# Altium project OpenAXES.PrjPCB
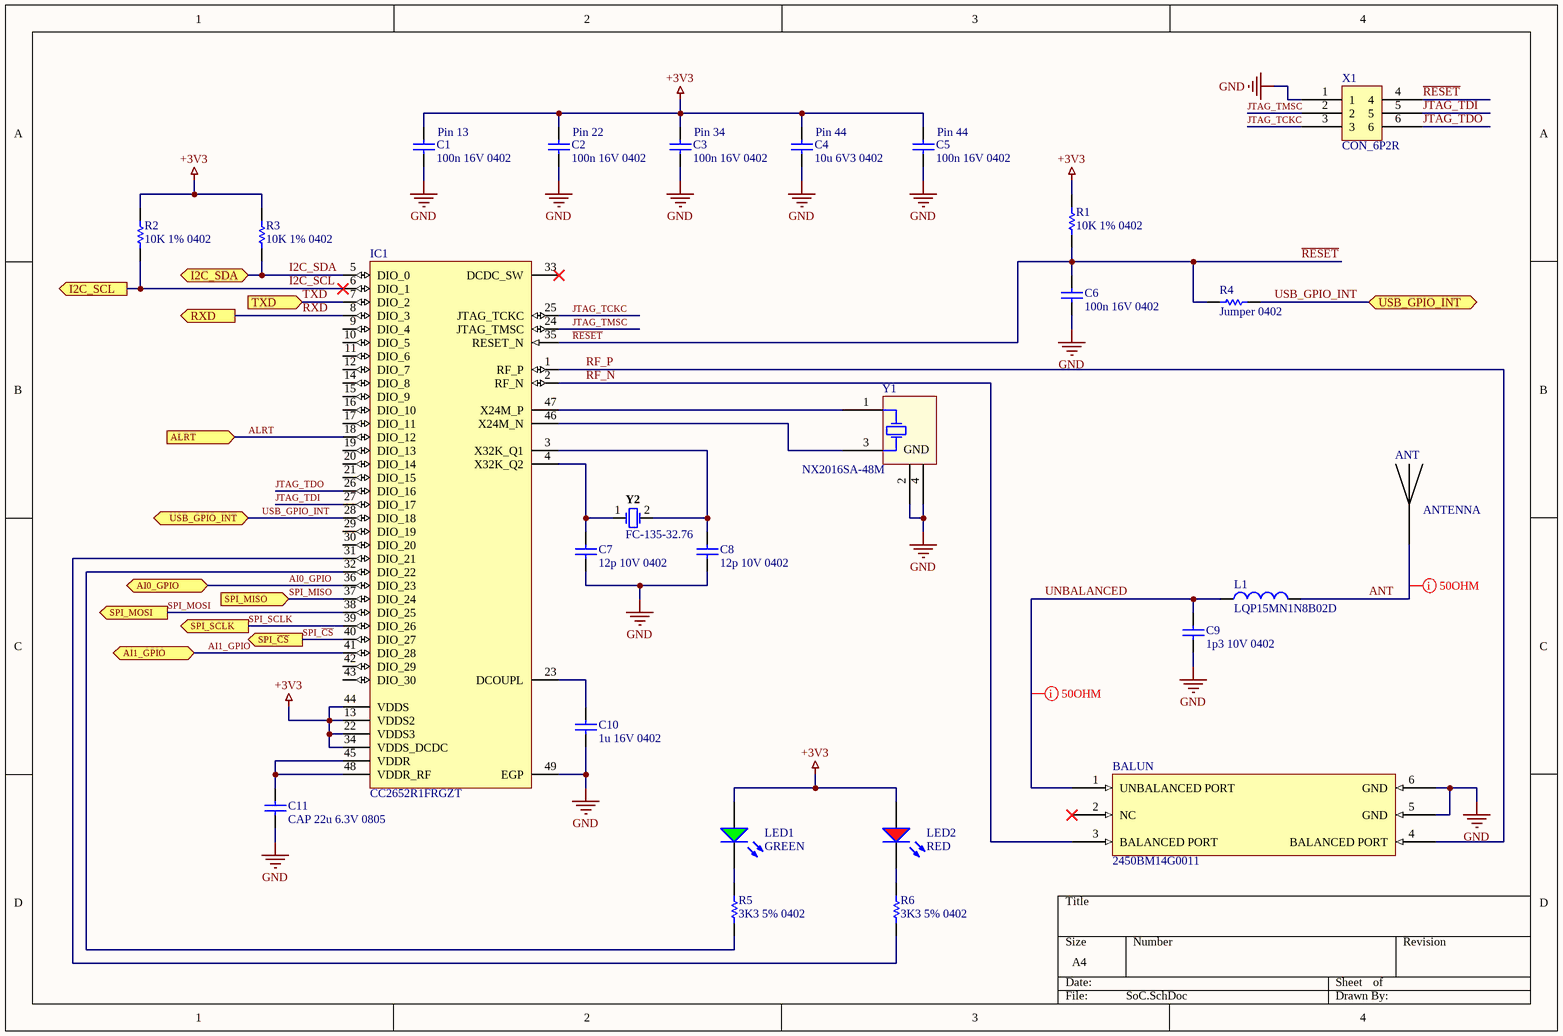
[diagram p0: SoC.SchDoc]
4 sheets, 99 parts. Net scope: flat (ports and power ports of the same name join across sheets).
Board files: OpenAXESpanel.PcbDoc, OpenAXES.PcbDoc
Sheets:
  SoC.SchDoc
  Battery.SchDoc
  USB2UART.SchDoc
  Sensors.SchDoc

## Sheet SoC.SchDoc
size A4

### Parts
ANT  ANTENNA  [MOLEX_47948-0001]
BALUN  2450BM14G0011  [SON50P80X70-6L]
C1  100n 16V 0402  [CAPC0402(1005)60_L]
C2  100n 16V 0402  [CAPC0402(1005)60_L]
C3  100n 16V 0402  [CAPC0402(1005)60_L]
C4  10u 6V3 0402  [CAPC0402(1005)60_L]
C5  100n 16V 0402  [CAPC0402(1005)60_L]
C6  100n 16V 0402  [CAPC0402(1005)60_L]
C7  12p 10V 0402  [CAPC0402(1005)60_L]
C8  12p 10V 0402  [CAPC0402(1005)60_L]
C9  1p3 10V 0402  [CAPC0402(1005)60_M]
C10  1u 16V 0402  [CAPC0402(1005)60_N]
C11  CAP 22u 6.3V 0805  [CAPC0805(2012)145_L]
IC1  CC2652R1FRGZT  [RGZ0048A_V]
L1  LQP15MN1N8B02D  [INDC1005X45X25ML10T10]
LED1  GREEN  [LED_0402]
LED2  RED  [LED_0402]
R1  10K 1% 0402  [RESC0402(1005)_L]
R2  10K 1% 0402  [RESC0402(1005)_L]
R3  10K 1% 0402  [RESC0402(1005)_L]
R4  Jumper 0402  [RESC0402(1005)_L]
R5  3K3 5% 0402  [RESC0402(1005)_L]
R6  3K3 5% 0402  [RESC0402(1005)_L]
X1  CON_6P2R  [JTAG_Con]
Y1  NX2016SA-48M  [Crystal_2016]
Y2  FC-135-32.76  [EPSON-FC-135_V]

### Ports
AI0_GPIO (bidir), AI1_GPIO (bidir), ALRT (in), I2C_SCL (out), I2C_SDA (bidir), RXD (out), SPI_MISO (in), SPI_MOSI (out), SPI_SCLK (out), SPI_~{CS} (out), TXD (in), USB_GPIO_INT (bidir)

### Nets
+3V3: C1.2 C2.2 C3.2 C4.2 C5.2 IC1.13(VDDS2) IC1.22(VDDS3) IC1.34(VDDS_DCDC) IC1.44(VDDS) LED1.ANODE LED2.ANODE R1.2 R2.2 R3.2
GND: BALUN.5(GND) BALUN.6(GND) C1.1 C2.1 C3.1 C4.1 C5.1 C6.1 C7.1 C8.1 C9.1 C10.1 C11.1 IC1.49(EGP) X1.1 Y1.2(GND) Y1.4(GND)
AI0_GPIO: IC1.36(DIO_23) ; port AI0_GPIO
AI1_GPIO: IC1.41(DIO_28) ; port AI1_GPIO
ALRT: IC1.18(DIO_12) ; port ALRT
ANT: ANT.ANTENNA L1.2
I2C_SCL: IC1.6(DIO_1) R2.1 ; port I2C_SCL
I2C_SDA: IC1.5(DIO_0) R3.1 ; port I2C_SDA
JTAG_TCKC: IC1.25(JTAG_TCKC) X1.3
JTAG_TDI: IC1.27(DIO_17) X1.5
JTAG_TDO: IC1.26(DIO_16) X1.6
JTAG_TMSC: IC1.24(JTAG_TMSC) X1.2
~{RESET}: C6.2 IC1.35(RESET_N) R1.1 R4.1 X1.4
RF_N: BALUN.3(BALANCED_PORT) IC1.2(RF_N)
RF_P: BALUN.4(BALANCED_PORT) IC1.1(RF_P)
RXD: IC1.8(DIO_3) ; port RXD
SPI_~{CS}: IC1.40(DIO_27) ; port SPI_~{CS}
SPI_MISO: IC1.37(DIO_24) ; port SPI_MISO
SPI_MOSI: IC1.38(DIO_25) ; port SPI_MOSI
SPI_SCLK: IC1.39(DIO_26) ; port SPI_SCLK
TXD: IC1.7(DIO_2) ; port TXD
UNBALANCED: BALUN.1(UNBALANCED_PORT) C9.2 L1.1
USB_GPIO_INT: IC1.28(DIO_18) R4.2 ; port USB_GPIO_INT
NetC7_2: C7.2 IC1.4(X32K_Q2) Y2.1
NetC8_2: C8.2 IC1.3(X32K_Q1) Y2.2
NetC10_2: C10.2 IC1.23(DCOUPL)
NetC11_2: C11.2 IC1.45(VDDR) IC1.48(VDDR_RF)
NetIC1_31: IC1.31(DIO_21) R6.1
NetIC1_32: IC1.32(DIO_22) R5.1
NetIC1_46: IC1.46(X24M_N) Y1.3(X2)
NetIC1_47: IC1.47(X24M_P) Y1.1(X1)
NetLED1_CATHODE: LED1.CATHODE R5.2
NetLED2_CATHODE: LED2.CATHODE R6.2

Not connected (* = marked no-connect by the designer): BALUN 2(NC)*; IC1 9(DIO_4) 10(DIO_5) 11(DIO_6) 12(DIO_7) 14(DIO_8) 15(DIO_9) 16(DIO_10) 17(DIO_11) 19(DIO_13) 20(DIO_14) 21(DIO_15) 29(DIO_19) 30(DIO_20) 33(DCDC_SW)* 42(DIO_29) 43(DIO_30)

### Layout directives
rule Impedance Constraint [Min = 45.00    Max = 55.00    ]; net class S50: ANT, UNBALANCED

### Notes on the sheet
- (near C1) Pin 13
- (near C2) Pin 22
- (near C3) Pin 34
- (near C4) Pin 44
- (near C5) Pin 44

### Library data of the parts
C1-C3 C5 C6 = CMP-1034-02069-1: CAP 100nF 16V ±10% 0402 (1005 Metric) Thickness 0.6mm SMD; Case-EIA: 0402; Case-Metric: 1005; Tolerance: Â±10%; Value: 100nF; Max Thickness: 0.6 mm; Rated Voltage: 16 V; Technology: SMT
C4 = CMP-1034-02138-1: CAP 10uF 6.3V ±20% 0402 (1005 Metric) Thickness 0.6mm SMD; Case-Metric: 1005; Case-EIA: 0402; Tolerance: Â±20%; Rated Voltage: 6.3 V; Technology: SMT; Max Thickness: 0.6 mm; Value: 10uF
C7 C8 = CMP-1034-00749-1: CAP 12pF 10V ±1% 0402 (1005 Metric) Thickness 0.6mm SMD; Tolerance: Â±1%; Case-EIA: 0402; Case-Metric: 1005; Technology: SMT; Max Thickness: 0.6 mm; Value: 12pF; Rated Voltage: 10 V
C9 = CMP-1034-00089-1: CAP 1.3pF 10V ±0.25pF 0402 (1005 Metric) Thickness 0.6mm SMD; Case-EIA: 0402; Tolerance: Â±0.25pF; Case-Metric: 1005; Max Thickness: 0.6 mm; Value: 1.3pF; Rated Voltage: 10 V; Technology: SMT
C10 = CMP-1034-02119-1: CAP 1uF 16V ±10% 0402 (1005 Metric) Thickness 0.6mm SMD; Case-EIA: 0402; Tolerance: Â±10%; Case-Metric: 1005; Technology: SMT; Rated Voltage: 16 V; Max Thickness: 0.6 mm; Value: 1uF
C11 = CMP-1036-04938-1: CAP 22uF 6.3V ±10% 0805 (2012 Metric) Thickness 1.45mm SMD; Tolerance: Â±10%; Case-EIA: 0805; Case-Metric: 2012; Technology: SMT; Rated Voltage: 6.3 V; Max Thickness: 1.45 mm; Value: 22uF
IC1 = CMP-2000-06080-1: CC2650 SimpleLink(TM) Multistandard Wireless MCU, 1.8 to 3.8 V, -40 to 85 degC, 48-Pin VFQFN, Green (RoHS & no Sb/Br), Tape and Reel; Manufacturer: Texas Instruments; Minimum Operating Supply Voltage: 1.8V; Maximum Operating Supply Voltage: 3.8V; Maximum Speed: 48MHz; Lead Finish: GoldOverNickelPalladium; Screening Level: Industrial; Program Memory Size: 128KB; Max Processing Temp: 260; Operating Supply Voltage: 2.5; RAM Size: 30KB; Operating Temperature: -40to85C; Datasheet URL: http://www.ti.com/lit/ds/symlink/cc2650.pdf; Manufacturer URL: http://www.ti.com/; Datasheet Version: Rev. B, 07/2016; Category: MicrocontrollerTools; Package Description: 48-Pin Quad Flat No-lead Package, Body 7 x 7 mm, Pitch 0.5 mm; Package Reference: RGZ0048A; Mounting Technology: SurfaceMount; Mounting: SurfaceMount
L1 = CMP-2000-06590-1: Chip Inductor, 1.8 nH, +/- 0.1 nH, 280 mA, -40 to 85 degC, 0402 (1005 Metric), RoHS, Tape and Reel; Manufacturer: Murata; DC Resistance: 0.2O; Tolerance (nH): ±0.1nH; Rated Current-Max: 280mA; Inductance-Nom: 1.8nH; Manufacturer URL: http://www.murata.com/; Mounting Technology: SurfaceMount; Datasheet URL: http://search.murata.co.jp/Ceramy/image/img/PDF/ENG/L0075S0084LQP15M.pdf; Datasheet Version: 09/2010; Package Reference: 0402; Case Size/Dimension: 0402; Package Description: 2-Pin Surface Mount Device, Body 1 x 0.5 mm
LED1 LED2 = LED: Generic 0402 LED
R1-R3 = CMP-1011-00623-1: 10K 0.063W 1% 0402 (1005 Metric)  SMD; Case-Metric: 1005; Value: 10000.00 Ohm; Case-EIA: 0402; Tolerance: 1 %; Technology: SMT; Power: 0.063 W
R4 = CMP-1011-00001-1: Jumper 0402 (1005 Metric); Tolerance: None; Case-Metric: 1005; Case-EIA: 0402; Value: 0.00 Ohm; Power: None; Technology: SMT
R5 R6 = CMP-1011-00086-1: 3K3 0.063W 5% 0402 (1005 Metric)  SMD; Case-EIA: 0402; Value: 3300.00 Ohm; Case-Metric: 1005; Power: 0.063 W; Technology: SMT; Tolerance: 5 %
Y1 = NX2016SA
Y2 = CMP-2100-03637-1: Crystal Unit, 32 to 77.5 KHz, 0.5 uW, -40 to 85 degC, 2-Pin SMD, RoHS; Manufacturer: Epson; RoHSCompliant: false; Datasheet URL: http://www5.epsondevice.com/en/products/khz_range/fc135r.html#; Datasheet Version: 42036.0; Manufacturer URL: https://www.eea.epson.com/; Package Reference: FC-135; Package Description: 2-Pin Surface Mount Device, Body 3.2 x 1.5 mm

## Sheet Battery.SchDoc
size A4
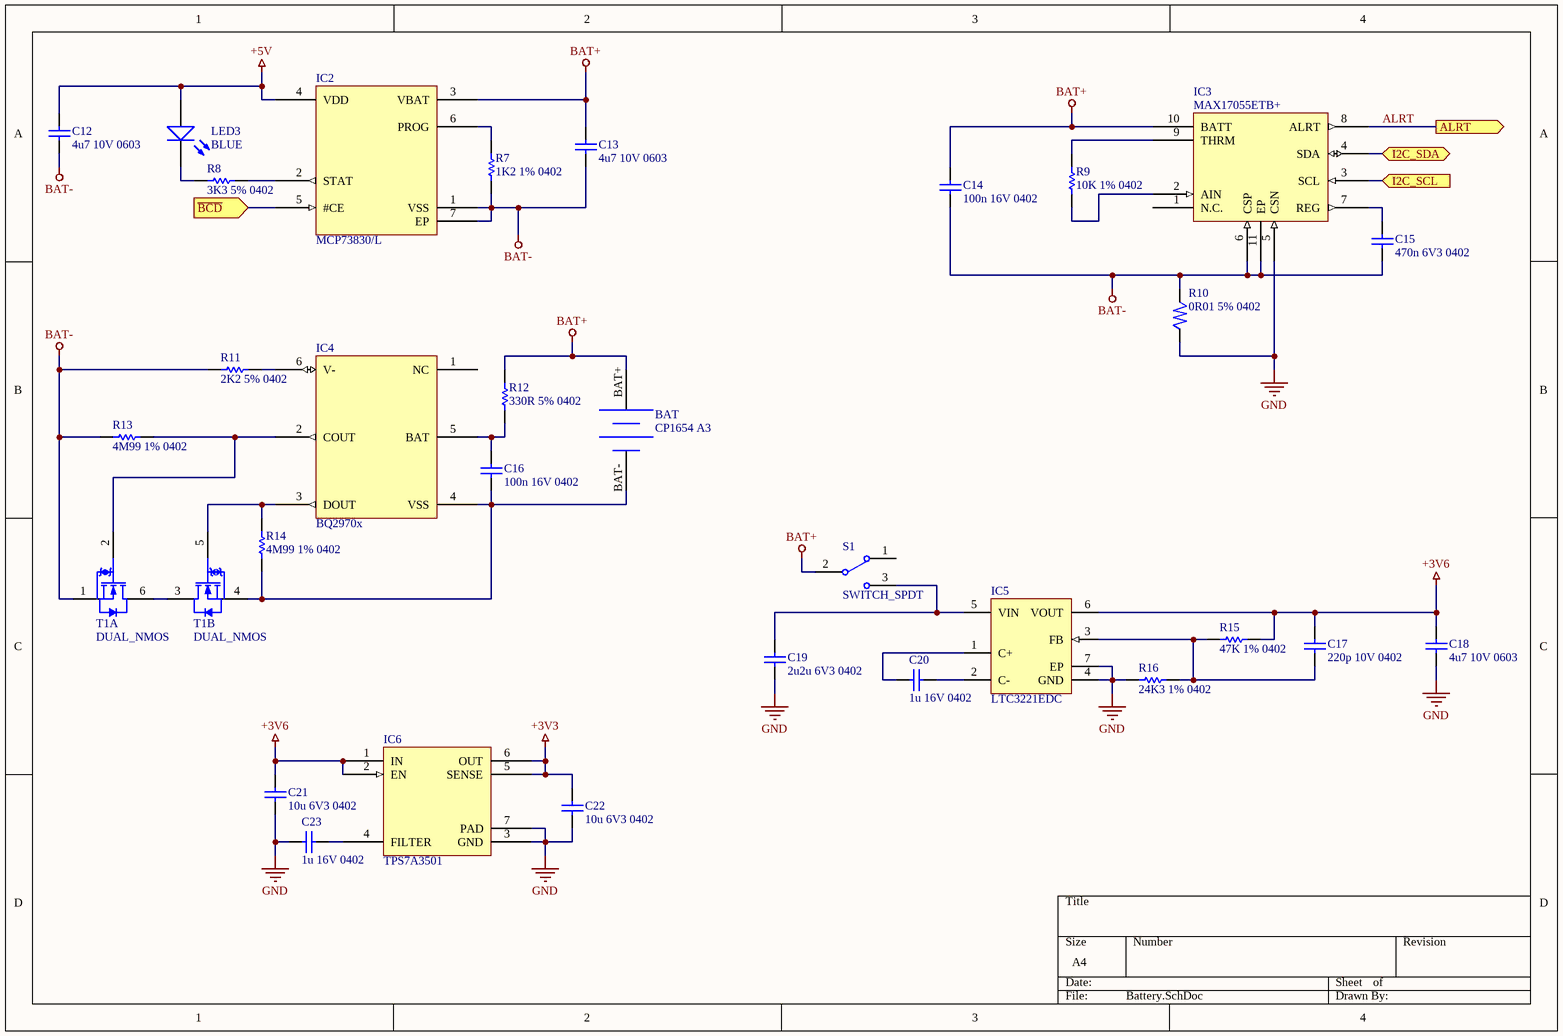
[diagram p1: Battery.SchDoc]

### Parts
BAT  CP1654 A3  [CP1654]
C12  4u7 10V 0603  [CAPC0603(1608)100_L]
C13  4u7 10V 0603  [CAPC0603(1608)100_L]
C14  100n 16V 0402  [CAPC0402(1005)60_L]
C15  470n 6V3 0402  [CAPC0402(1005)60_L]
C16  100n 16V 0402  [CAPC0402(1005)60_L]
C17  220p 10V 0402  [CAPC0402(1005)60_L]
C18  4u7 10V 0603  [CAPC0603(1608)100_L]
C19  2u2u 6V3 0402  [CAPC0402(1005)60_L]
C20  1u 16V 0402  [CAPC0402(1005)60_L]
C21  10u 6V3 0402  [CAPC0402(1005)60_L]
C22  10u 6V3 0402  [CAPC0402(1005)60_L]
C23  1u 16V 0402  [CAPC0402(1005)60_L]
IC2  MCP73830/L  [PSON50P200X80_HS-7L]
IC3  MAX17055ETB+  [PSON40P250X80_HS-11L]
IC4  BQ2970x  [SON50P150X80-6L]
IC5  LTC3221EDC  [LT-DC6-6_V]
IC6  TPS7A3501  [PSON65P200X80_HS-7L]
LED3  BLUE  [LED_0402]
R7  1K2 1% 0402  [RESC0402(1005)_L]
R8  3K3 5% 0402  [RESC0402(1005)_L]
R9  10K 1% 0402  [RESC0402(1005)_L]
R10  0R01 5% 0402  [R0402]
R11  2K2 5% 0402  [RESC0402(1005)_L]
R12  330R 5% 0402  [RESC0402(1005)_L]
R13  4M99 1% 0402  [RESC0402(1005)_L]
R14  4M99 1% 0402  [RESC0402(1005)_L]
R15  47K 1% 0402  [RESC0402(1005)_L]
R16  24K3 1% 0402  [RESC0402(1005)_L]
S1  SWITCH_SPDT  [SSSS810701_MODIFIED]
T1  DUAL_NMOS  [WDFN6 2x2, 0.65P]  (parts A,B of 2)

### Ports
ALRT (out), I2C_SCL (in), I2C_SDA (bidir), ~{BCD} (in)

### Nets
+3V3: C22.2 IC6.5(SENSE) IC6.6(OUT)
+3V6: C17.2 C18.2 C21.2 IC5.6(VOUT) IC6.1(IN) IC6.2(EN) R15.2
+5V: C12.2 IC2.4(VDD) LED3.ANODE
BAT+: BAT.BAT+ C13.2 C14.2 IC2.3(VBAT) IC3.10(BATT) R12.2 S1.2
BAT-: C12.1 C13.1 C14.1 C15.1 IC2.1(VSS) IC2.7(EP) IC3.6(CSP) IC3.11(EP) R7.1 R10.1 R11.1 R13.1 T1.1(S1)
GND: C18.1 C19.1 C21.1 C22.1 C23.2 IC3.5(CSN) IC5.4(GND) IC5.7(EP) IC6.3(GND) IC6.7(PAD) R10.2 R16.1
ALRT: IC3.8(ALRT) ; port ALRT
BCD: IC2.5(#CE) ; port ~{BCD}
I2C_SCL: IC3.3(SCL) ; port I2C_SCL
I2C_SDA: IC3.4(SDA) ; port I2C_SDA
NetBAT_BAT-: BAT.BAT- C16.1 IC4.4(VSS) R14.1 T1.4(S2)
NetC15_2: C15.2 IC3.7(REG)
NetC16_2: C16.2 IC4.5(BAT) R12.1
NetC17_1: C17.1 IC5.3(FB) R15.1 R16.2
NetC19_2: C19.2 IC5.5(VIN) S1.3
NetC20_1: C20.1 IC5.2(C-)
NetC20_2: C20.2 IC5.1(C+)
NetC23_1: C23.1 IC6.4(FILTER)
NetIC2_2: IC2.2(STAT) R8.2
NetIC2_6: IC2.6(PROG) R7.2
NetIC3_2: IC3.2(AIN) R9.1
NetIC3_9: IC3.9(THRM) R9.2
NetIC4_2: IC4.2(COUT) R13.2 T1.2(G1)
NetIC4_3: IC4.3(DOUT) R14.2 T1.5(G2)
NetIC4_6: IC4.6(V-) R11.2
NetLED3_CATHODE: LED3.CATHODE R8.1
NetT1_3: T1.3(D2) T1.6(D1)

Not connected (* = marked no-connect by the designer): IC3 1(N.C.); IC4 1(NC); S1 1(2)

### Library data of the parts
BAT = Battery
C12 C13 C18 = CMP-1035-02787-1: CAP 4.7uF 10V ±20% 0603 (1608 Metric) Thickness 1mm SMD; Case-EIA: 0603; Case-Metric: 1608; Tolerance: Â±20%; Value: 4.7uF; Max Thickness: 1 mm; Technology: SMT; Rated Voltage: 10 V
C14 C16 = CMP-1034-02069-1: as C1 on sheet SoC; Value: 100nF; Max Thickness: 0.6 mm; Rated Voltage: 16 V; Technology: SMT
C15 = CMP-1034-02103-1: CAP 470nF 6.3V ±10% 0402 (1005 Metric) Thickness 0.6mm SMD; Tolerance: Â±10%; Case-Metric: 1005; Case-EIA: 0402; Rated Voltage: 6.3 V; Value: 470nF; Technology: SMT; Max Thickness: 0.6 mm
C17 = CMP-1034-01354-1: CAP 220pF 10V ±5% 0402 (1005 Metric) Thickness 0.6mm SMD; Case-Metric: 1005; Tolerance: Â±5%; Case-EIA: 0402; Rated Voltage: 10 V; Max Thickness: 0.6 mm; Technology: SMT; Value: 220pF
C19 = CMP-1034-02125-1: CAP 2.2uF 6.3V ±10% 0402 (1005 Metric) Thickness 0.6mm SMD; Case-Metric: 1005; Case-EIA: 0402; Tolerance: Â±10%; Value: 2.2uF; Technology: SMT; Rated Voltage: 6.3 V; Max Thickness: 0.6 mm
C20 C23 = CMP-1034-02119-1: as C10 on sheet SoC; Technology: SMT; Rated Voltage: 16 V; Max Thickness: 0.6 mm; Value: 1uF
C21 C22 = CMP-1034-02138-1: as C4 on sheet SoC; Rated Voltage: 6.3 V; Technology: SMT; Max Thickness: 0.6 mm; Value: 10uF
IC5 = CMP-0475-00008-3: Micropower, Regulated Charge Pump, 1.8 to 5.5 V Vin, Adjustable Vout, 6-pin SON (DC6-6), -40 to 85 degC; Manufacturer: Linear Technology; Voutput: Adj; Isupply(mA): 0.005; Vin Min(V): 1.8; Frequency(kHz): 600; Max Iout(mA): 60; Vin Max(V): 5.5; PackageDescription: 6-Pin Plastic DFN, Body 2 x 2 mm, Pitch 0.5 mm; ComponentLink3URL: http://cds.linear.com/docs/en/packaging/DFN_6_05-08-1703.pdf; RoHS: FALSE; Code_JEDEC: MO-229; ComponentLink1URL: http://www.linear.com/; ComponentLink1Description: Manufacturer URL; PackageVersion: Rev. B, 06/2010; ComponentLink3Description: Package Specification; ComponentLink2URL: http://cds.linear.com/docs/en/datasheet/3221f.pdf; ComponentLink2Description: Datasheet; Mounting Technology: Surface Mount; PartNumber: LTC3221EDC; PackageReference: DC6-6
LED3 = LED: Generic 0402 LED
R7 = CMP-1011-00518-1: 1K2 0.063W 1% 0402 (1005 Metric)  SMD; Value: 1200.00 Ohm; Case-EIA: 0402; Case-Metric: 1005; Technology: SMT; Power: 0.063 W; Tolerance: 1 %
R8 = CMP-1011-00086-1: as R5 on sheet SoC; Power: 0.063 W; Technology: SMT; Tolerance: 5 %
R9 = CMP-1011-00623-1: as R1 on sheet SoC; Tolerance: 1 %; Technology: SMT; Power: 0.063 W
R10 = Resistor
R11 = CMP-1011-00082-1: 2K2 0.063W 5% 0402 (1005 Metric)  SMD; Value: 2200.00 Ohm; Case-EIA: 0402; Case-Metric: 1005; Tolerance: 5 %; Power: 0.063 W; Technology: SMT
R12 = CMP-1011-00062-1: 330R 0.063W 5% 0402 (1005 Metric)  SMD; Case-EIA: 0402; Value: 330.00 Ohm; Case-Metric: 1005; Tolerance: 5 %; Technology: SMT; Power: 0.063 W
R13 R14 = CMP-1011-00928-1: 4M99 0.063W 1% 0402 (1005 Metric)  SMD; Case-EIA: 0402; Case-Metric: 1005; Value: 4990000.00 Ohm; Technology: SMT; Tolerance: 1 %; Power: 0.063 W
R15 = CMP-1011-00699-1: 47K 0.063W 1% 0402 (1005 Metric)  SMD; Case-EIA: 0402; Case-Metric: 1005; Value: 47000.00 Ohm; Power: 0.063 W; Technology: SMT; Tolerance: 1 %
R16 = CMP-1011-00665-1: 24K3 0.063W 1% 0402 (1005 Metric)  SMD; Value: 24300.00 Ohm; Case-EIA: 0402; Case-Metric: 1005; Technology: SMT; Tolerance: 1 %; Power: 0.063 W

## Sheet USB2UART.SchDoc
size A4
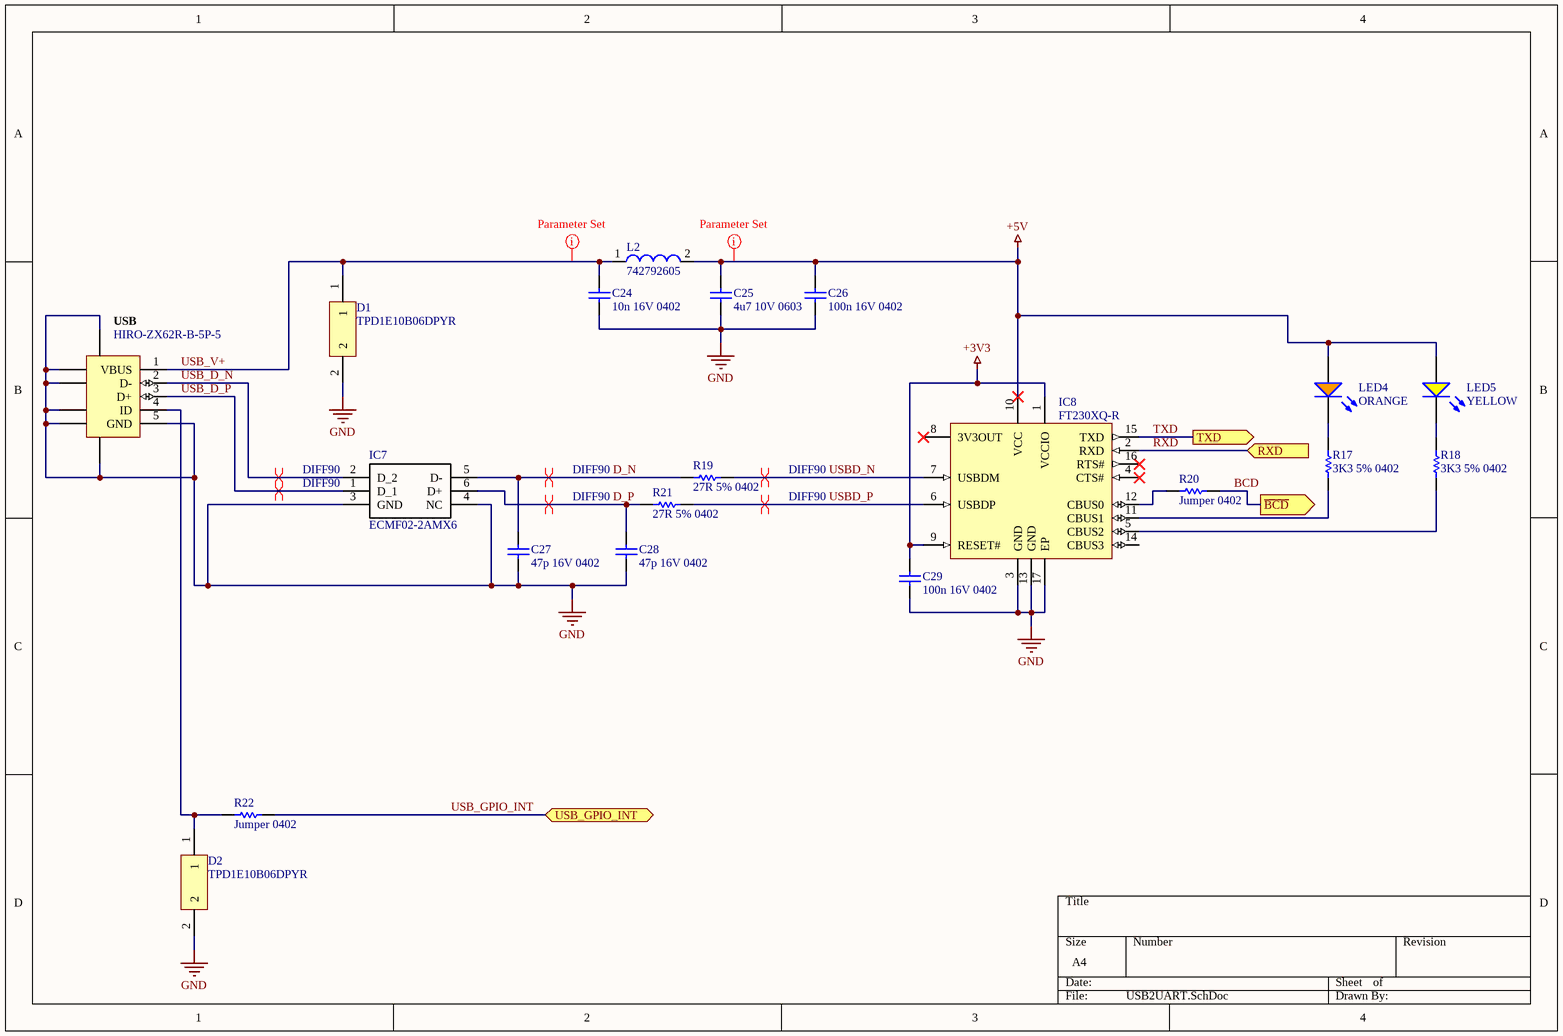
[diagram p2: USB2UART.SchDoc]

### Parts
C24  10n 16V 0402  [CAPC0402(1005)33_L]
C25  4u7 10V 0603  [CAPC0603(1608)100_L]
C26  100n 16V 0402  [CAPC0402(1005)60_L]
C27  47p 16V 0402  [CAPC0402(1005)60_L]
C28  47p 16V 0402  [CAPC0402(1005)60_L]
C29  100n 16V 0402  [CAPC0402(1005)60_N]
D1  TPD1E10B06DPYR  [DPY0002A_M]
D2  TPD1E10B06DPYR  [DPY0002A_M]
IC7  ECMF02-2AMX6  [SON50P150X170X55-6N-D]
IC8  FT230XQ-R  [QFN-16_L]
L2  742792605  [0603(1608)_L]
LED4  ORANGE  [LED_0402]
LED5  YELLOW  [LED_0402]
R17  3K3 5% 0402  [RESC0402(1005)_L]
R18  3K3 5% 0402  [RESC0402(1005)_L]
R19  27R 5% 0402  [RESC0402(1005)_L]
R20  Jumper 0402  [RESC0402(1005)_L]
R21  27R 5% 0402  [RESC0402(1005)_L]
R22  Jumper 0402  [RESC0402(1005)_L]
USB  HIRO-ZX62R-B-5P-5  [HIRO-ZX62R-B-5P_V]

### Ports
RXD (in), TXD (out), USB_GPIO_INT (bidir), ~{BCD} (out)

### Nets
+3V3: C29.2 IC8.1(VCCIO) IC8.9(RESET#)
+5V: C25.2 C26.2 IC8.10(VCC) L2.2 LED4.ANODE LED5.ANODE
GND: C24.1 C25.1 C26.1 C27.1 C28.1 C29.1 D1.2 D2.2 IC7.3(GND) IC7.4(NC) IC8.3(GND) IC8.13(GND) IC8.17(EP) USB.5(GND) USB.6(SHLD) USB.7(SHLD) USB.8(SHLD) USB.9(SHLD) USB.10(SHLD) USB.11(SHLD)
BCD: R20.2 ; port ~{BCD}
D_N: C27.2 IC7.5(D-) R19.1
D_P: C28.2 IC7.6(D+) R21.1
RXD: IC8.2(RXD) ; port RXD
TXD: IC8.15(TXD) ; port TXD
USB_D_N: IC7.2(D_2) USB.2(D-)
USB_D_P: IC7.1(D_1) USB.3(D+)
USB_GPIO_INT: R22.2 ; port USB_GPIO_INT
USB_V+: C24.2 D1.1 L2.1 USB.1(VBUS)
USBD_N: IC8.7(USBDM) R19.2
USBD_P: IC8.6(USBDP) R21.2
NetD2_1: D2.1 R22.1 USB.4(ID)
NetIC8_5: IC8.5(CBUS2) R18.1
NetIC8_11: IC8.11(CBUS1) R17.1
NetIC8_12: IC8.12(CBUS0) R20.1
NetLED4_CATHODE: LED4.CATHODE R17.2
NetLED5_CATHODE: LED5.CATHODE R18.2

Not connected (* = marked no-connect by the designer): IC8 4(CTS#)* 8(3V3OUT)* 14(CBUS3) 16(RTS#)*

### Layout directives
differential pair; net class DIFF90: D_N, D_P, USB_D_N, USB_D_P, USBD_N, USBD_P
rule Width Constraint [Pref Width = 0.254mm    Min Width = 0.254mm    Max Width = 0.5mm]: +5V, USB_V+

### Library data of the parts
C24 = CMP-1034-01875-1: CAP 10nF 16V ±10% 0402 (1005 Metric) Thickness 0.33mm SMD; Case-EIA: 0402; Tolerance: Â±10%; Case-Metric: 1005; Value: 10nF; Max Thickness: 0.33 mm; Rated Voltage: 16 V; Technology: SMT
C25 = CMP-1035-02787-1: as C12 on sheet Battery; Value: 4.7uF; Max Thickness: 1 mm; Technology: SMT; Rated Voltage: 10 V
C26 C29 = CMP-1034-02069-1: as C1 on sheet SoC; Value: 100nF; Max Thickness: 0.6 mm; Rated Voltage: 16 V; Technology: SMT
C27 C28 = CMP-1034-01081-1: CAP 47pF 16V ±10% 0402 (1005 Metric) Thickness 0.6mm SMD; Case-EIA: 0402; Case-Metric: 1005; Tolerance: Â±10%; Rated Voltage: 16 V; Technology: SMT; Value: 47pF; Max Thickness: 0.6 mm
D1 D2 = CMP-0326-00004-2: ESD in 0402 Package with 10 pF Capacitance and 6 V Breakdown, 1 Channel, -40 to +125 degC, 2-pin X2SON (DPY), Green (RoHS & no Sb/Br); Manufacturer: Texas Instruments; SubFamily: ESD Solution; IEC 61000-4-2 Air-Gap(+/- kV): 30; Eco-Plan: TBD; IO Capacitance(Typ)(pF): 10; Breakdown Voltage(Min)(V): 6; ComponentLink3Description: URL Link1; PackageVersion: revA, Apr-2010; Mounting Technology: Surface Mount; PackageReference: DPY0002A; PackageDescription: 2-Pin Plastic Small Outline No-Lead 1.0 x 0.6 x 0.4 mm Body; ComponentLink2URL: http://www.ti.com/general/docs/lit/getliterature.tsp?genericPartNumber=TPD1E10B06&fileType=pdf; ComponentLink1URL: http://www.ti.com/; ComponentLink3URL: SamplesURL:http://www.ti.com/product/tpd1e10b06#samples; IO Leakage Current(nA): 10; ComponentLink1Description: Manufacturer URL; DatasheetVersion: SLLSEB1; ComponentLink2Description: Datasheet; PartNumber: TPD1E10B06DPYR; IEC 61000-4-2 Contact(+/- kV): 30
IC7 = ECMF02-2AMX6: Integrated Circuit; Manufacturer_Name: STMicroelectronics; Datasheet Link: http://www.st.com/content/ccc/resource/technical/document/datasheet/3a/28/cf/d0/31/63/48/8c/CD00282307.pdf/files/CD00282307.pdf/jcr:content/translations/en.CD00282307.pdf; Height: 0.55mm; Manufacturer_Part_Number: ECMF02-2AMX6; Mouser Part Number: 511-ECMF02-2AMX6; Mouser Price/Stock: https://www.mouser.com/Search/Refine.aspx?Keyword=511-ECMF02-2AMX6; RS Part Number: 8805276; RS Price/Stock: https://uk.rs-online.com/web/p/products/8805276
IC8 = CMP-0248-00010-2: USB to Basic UART Interface Chip, UHCI/OHCI/EHCI Compatible, USB 2.0 Compatible, -40 to +85 degC, 16-Pin QFN, Pb-Free, Tape and Reel; Manufacturer: FTDI; ComponentLink2Description: Datasheet; DatasheetVersion: ver 1.2, Feb-2013; ComponentLink1Description: Manufacturer URL; PackageDescription: 16-Pin Quad Flat No-Lead, 4x4 mm Body, 0.65 mm Pitch; PackageVersion: Feb-13; ComponentLink3URL: www.ftdichip.com/Products/ICs/FT230X.html; Code_JEDEC: MO-220WGGC; RevisionNote: DatasheetVersion updated to 1.2 Feb-2013; ComponentLink1URL: http://www.ftdichip.com/; PackageReference: QFN-16; ComponentLink2URL: http://www.ftdichip.com/Support/Documents/DataSheets/ICs/DS_FT230X.pdf; PartNumber: FT230XQ-R; ComponentLink3Description: FT230X Product Page
L2 = CMP-0220-00044-1: SMD EMI Suppression Ferrite Bead WE-CBF, Z = 33 Ohm; Impedance: 33 Ohm; PackageVersion: 2005; ComponentLink1URL: http://www.we-online.com; ComponentLink1Description: Manufacturer Link; ComponentLink2Description: Datasheet; PackageDescription: Chip Inductor, 2-Leads, Body 2.0 x 1.2 mm; ComponentLink2URL: http://www.we-online.de/katalog/media/pdf/742792012.pdf; PackageReference: SMD-0805; DatasheetVersion: Dec-2005
LED4 LED5 = LED: Generic 0402 LED
R17 R18 = CMP-1011-00086-1: as R5 on sheet SoC; Power: 0.063 W; Technology: SMT; Tolerance: 5 %
R19 R21 = CMP-1011-00036-1: 27R 0.063W 5% 0402 (1005 Metric)  SMD; Case-EIA: 0402; Case-Metric: 1005; Value: 27.00 Ohm; Tolerance: 5 %; Power: 0.063 W; Technology: SMT
R20 R22 = CMP-1011-00001-1: as R4 on sheet SoC; Power: None; Technology: SMT

## Sheet Sensors.SchDoc
size A4
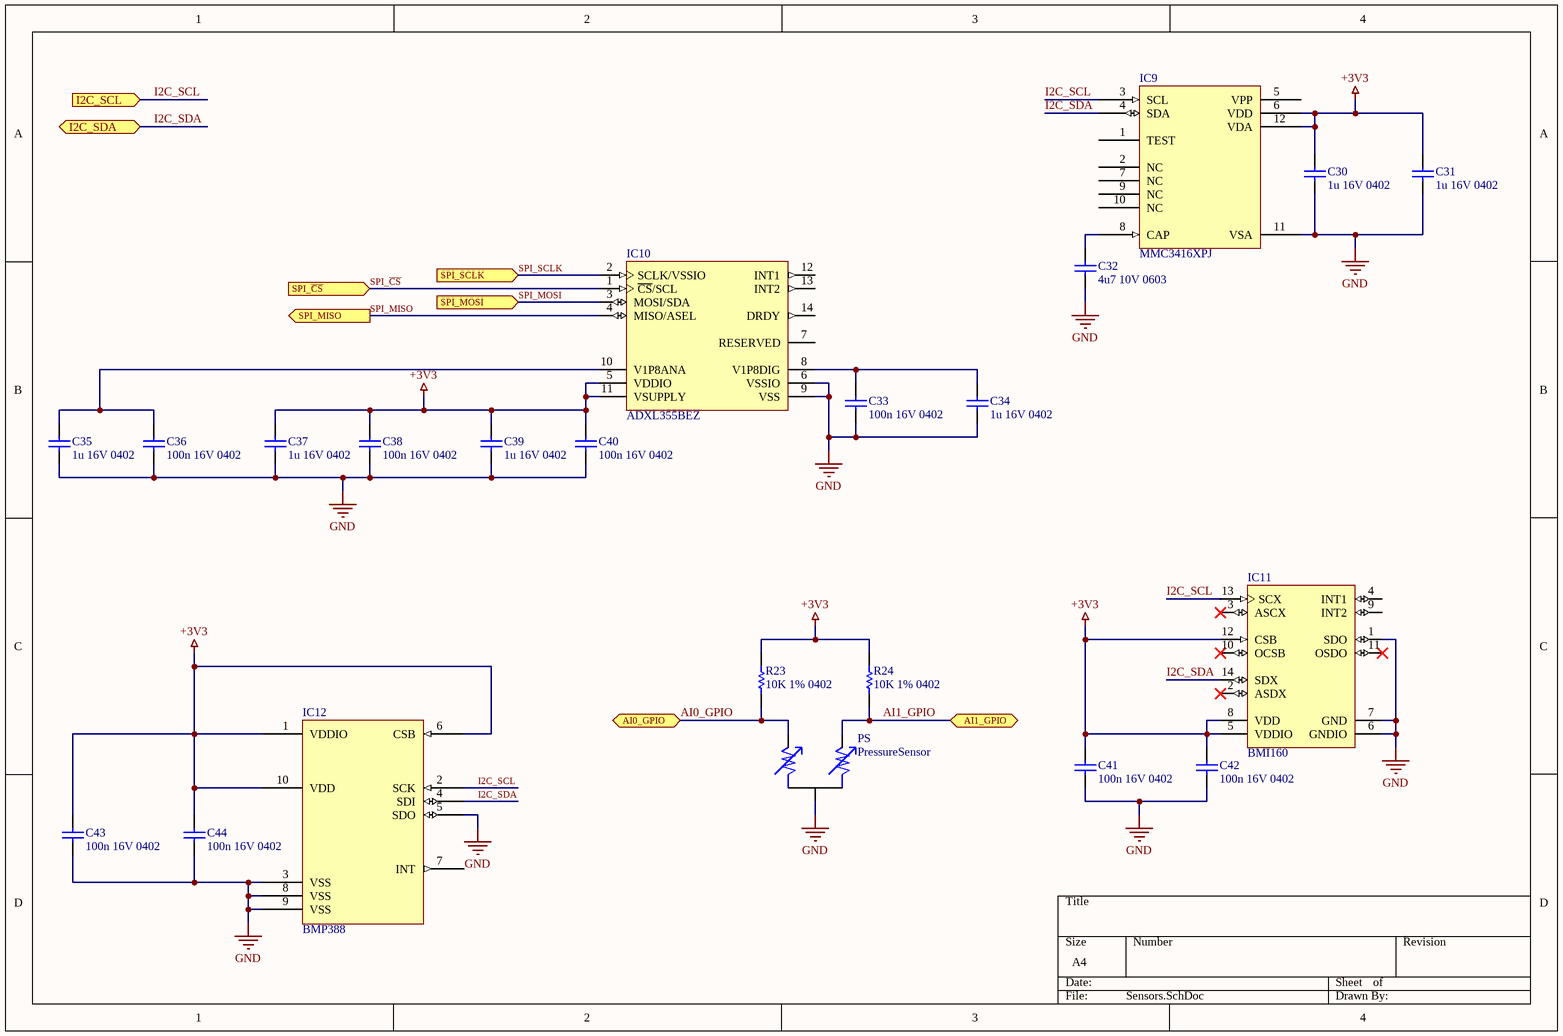
[diagram p3: Sensors.SchDoc]

### Parts
C30  1u 16V 0402  [CAPC0402(1005)60_L]
C31  1u 16V 0402  [CAPC0402(1005)60_L]
C32  4u7 10V 0603  [CAPC0603(1608)100_L]
C33  100n 16V 0402  [CAPC0402(1005)60_L]
C34  1u 16V 0402  [CAPC0402(1005)60_L]
C35  1u 16V 0402  [CAPC0402(1005)60_L]
C36  100n 16V 0402  [CAPC0402(1005)60_L]
C37  1u 16V 0402  [CAPC0402(1005)60_L]
C38  100n 16V 0402  [CAPC0402(1005)60_L]
C39  1u 16V 0402  [CAPC0402(1005)60_L]
C40  100n 16V 0402  [CAPC0402(1005)60_L]
C41  100n 16V 0402  [CAPC0402(1005)60_L]
C42  100n 16V 0402  [CAPC0402(1005)60_L]
C43  100n 16V 0402  [CAPC0402(1005)60_L]
C44  100n 16V 0402  [CAPC0402(1005)60_L]
IC9  MMC3416XPJ  [BGA12C40P4X4_160X160X72]
IC10  ADXL355BEZ  [ADI-ADXL355-LCC-14_V]
IC11  BMI160  [BOSC-BMI160_V]
IC12  BMP388  [BMP388]
PS  PressureSensor  [PressureSensor]
R23  10K 1% 0402  [RESC0402(1005)_L]
R24  10K 1% 0402  [RESC0402(1005)_L]

### Ports
AI0_GPIO (bidir), AI1_GPIO (bidir), I2C_SCL (in), I2C_SDA (bidir), SPI_MISO (out), SPI_MOSI (in), SPI_SCLK (in), SPI_~{CS} (in)

### Nets
+3V3: C30.1 C31.1 C37.1 C38.2 C39.1 C40.2 C41.2 C42.2 C43.2 C44.2 IC9.6(VDD) IC9.12(VDA) IC10.5(VDDIO) IC10.11(VSUPPLY) IC11.5(VDDIO) IC11.8(VDD) IC11.12(CSB) IC12.1(VDDIO) IC12.6(CSB) IC12.10(VDD) R23.2 R24.2
GND: C30.2 C31.2 C32.1 C33.1 C34.2 C35.2 C36.1 C37.2 C38.1 C39.2 C40.1 C41.1 C42.1 C43.1 C44.1 IC9.11(VSA) IC10.6(VSSIO) IC10.9(VSS) IC11.1(SDO) IC11.6(GNDIO) IC11.7(GND) IC12.3(VSS) IC12.5(SDO) IC12.8(VSS) IC12.9(VSS) PS.1
AI0_GPIO: PS.3 R23.1 ; port AI0_GPIO
AI1_GPIO: PS.2 R24.1 ; port AI1_GPIO
I2C_SCL: IC9.3(SCL) IC11.13(SCX) IC12.2(SCK) ; port I2C_SCL
I2C_SDA: IC9.4(SDA) IC11.14(SDX) IC12.4(SDI) ; port I2C_SDA
SPI_~{CS}: IC10.1(~{CS}/SCL) ; port SPI_~{CS}
SPI_MISO: IC10.4(MISO/ASEL) ; port SPI_MISO
SPI_MOSI: IC10.3(MOSI/SDA) ; port SPI_MOSI
SPI_SCLK: IC10.2(SCLK/VSSIO) ; port SPI_SCLK
NetC32_2: C32.2 IC9.8(CAP)
NetC33_2: C33.2 C34.1 IC10.8(V1P8DIG)
NetC35_1: C35.1 C36.2 IC10.10(V1P8ANA)

Not connected (* = marked no-connect by the designer): IC9 1(TEST) 2(NC) 5(VPP) 7(NC) 9(NC) 10(NC); IC10 7(RESERVED) 12(INT1) 13(INT2) 14(DRDY); IC11 2(ASDX)* 3(ASCX)* 4(INT1) 9(INT2) 10(OCSB)* 11(OSDO)*; IC12 7(INT)

### Library data of the parts
C30 C31 C34 C35 C37 C39 = CMP-1034-02119-1: as C10 on sheet SoC; Technology: SMT; Rated Voltage: 16 V; Max Thickness: 0.6 mm; Value: 1uF
C32 = CMP-1035-02787-1: as C12 on sheet Battery; Value: 4.7uF; Max Thickness: 1 mm; Technology: SMT; Rated Voltage: 10 V
C33 C36 C38 C40-C44 = CMP-1034-02069-1: as C1 on sheet SoC; Value: 100nF; Max Thickness: 0.6 mm; Rated Voltage: 16 V; Technology: SMT
IC10 = CMP-2000-07574-1: Low Noise, Low Drift, Low Power, 3-Axis MEMS Accelerometer, 2.25 to 3.6 V, -40 to 125 degC, 14-Pin LCC (E-14-1), RoHS, Tray; Manufacturer: Analog Devices; Datasheet URL: http://www.analog.com/media/en/technical-documentation/data-sheets/ADXL354_355.pdf; Package Reference: E-14-1; Manufacturer URL: http://www.analog.com/; Datasheet Version: Rev. 0, 09/2016; Package Description: 14-Pin Leadless Chip Carrier Package, Body 6.0 x 6.0 mm, Pitch 1.27 mm; RoHSCompliant: False; Mounting Technology: SurfaceMount; Number of Pins: 14; Lead Free: ContainsLead
IC11 = CMP-2000-07537-1: Small, low Power Inertial Measurement Unit, 1.2 to 3.6 V, -40 to 85 degC, 14-Pin LGA, Halogen-Free, Tape and Reel; Manufacturer: Bosch; Datasheet URL: https://ae-bst.resource.bosch.com/media/_tech/media/datasheets/BST-BMI160-DS000-07.pdf; Package Description: 14-Pullback Quad Flat No-Lead, Body 3 x 2.5 mm, Pitch 0.5 mm; Lead Free: LeadFree; Datasheet Version: Rev. 0.8, 02/2015; Mounting Technology: SurfaceMount; Manufacturer URL: https://www.bosch.com/; Package Reference: BMI160; RoHSCompliant: false
R23 R24 = CMP-1011-00623-1: as R1 on sheet SoC; Tolerance: 1 %; Technology: SMT; Power: 0.063 W

## Nets that join several sheets
+3V3: SoC (14 pins), Battery (C22.2 IC6.5 IC6.6), USB2UART (C29.2 IC8.1 IC8.9), Sensors (22 pins)
+5V: Battery (C12.2 IC2.4 LED3.ANODE), USB2UART (6 pins)
GND: SoC (17 pins), Battery (12 pins), USB2UART (20 pins), Sensors (26 pins)
AI0_GPIO: SoC (IC1.36), Sensors (PS.3 R23.1)
AI1_GPIO: SoC (IC1.41), Sensors (PS.2 R24.1)
ALRT: SoC (IC1.18), Battery (IC3.8)
BCD: Battery (IC2.5), USB2UART (R20.2)
I2C_SCL: SoC (IC1.6 R2.1), Battery (IC3.3), Sensors (IC9.3 IC11.13 IC12.2)
I2C_SDA: SoC (IC1.5 R3.1), Battery (IC3.4), Sensors (IC9.4 IC11.14 IC12.4)
RXD: SoC (IC1.8), USB2UART (IC8.2)
SPI_~{CS}: SoC (IC1.40), Sensors (IC10.1)
SPI_MISO: SoC (IC1.37), Sensors (IC10.4)
SPI_MOSI: SoC (IC1.38), Sensors (IC10.3)
SPI_SCLK: SoC (IC1.39), Sensors (IC10.2)
TXD: SoC (IC1.7), USB2UART (IC8.15)
USB_GPIO_INT: SoC (IC1.28 R4.2), USB2UART (R22.2)